# EAGLE design quahog_0.1.0 (EAGLE 7.6.0)
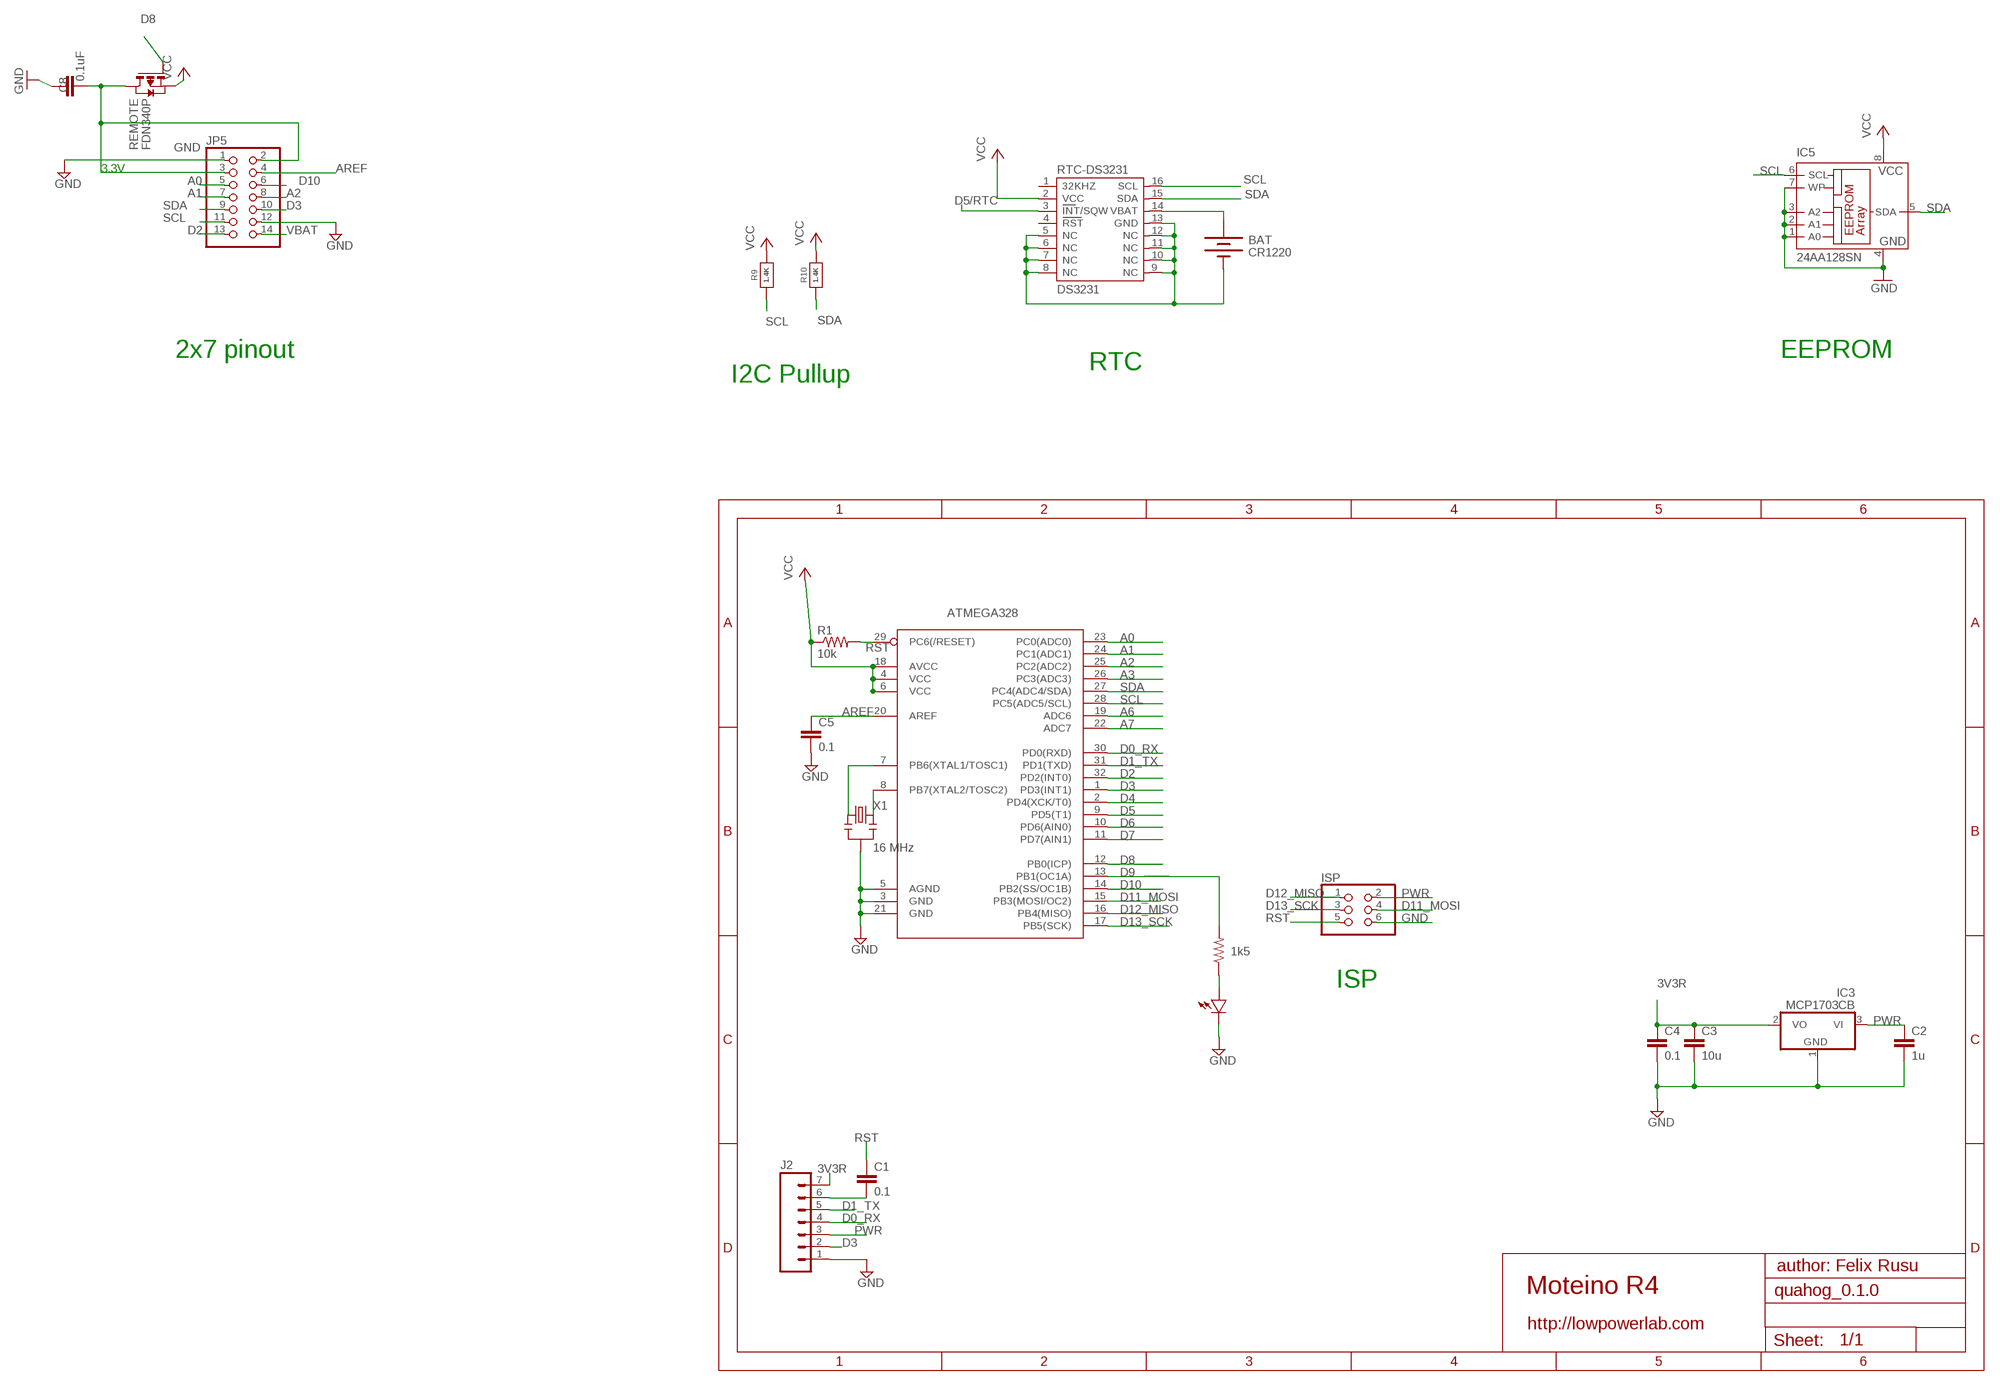
[diagram p0: schematic, sheet 1, part 1 of 2]
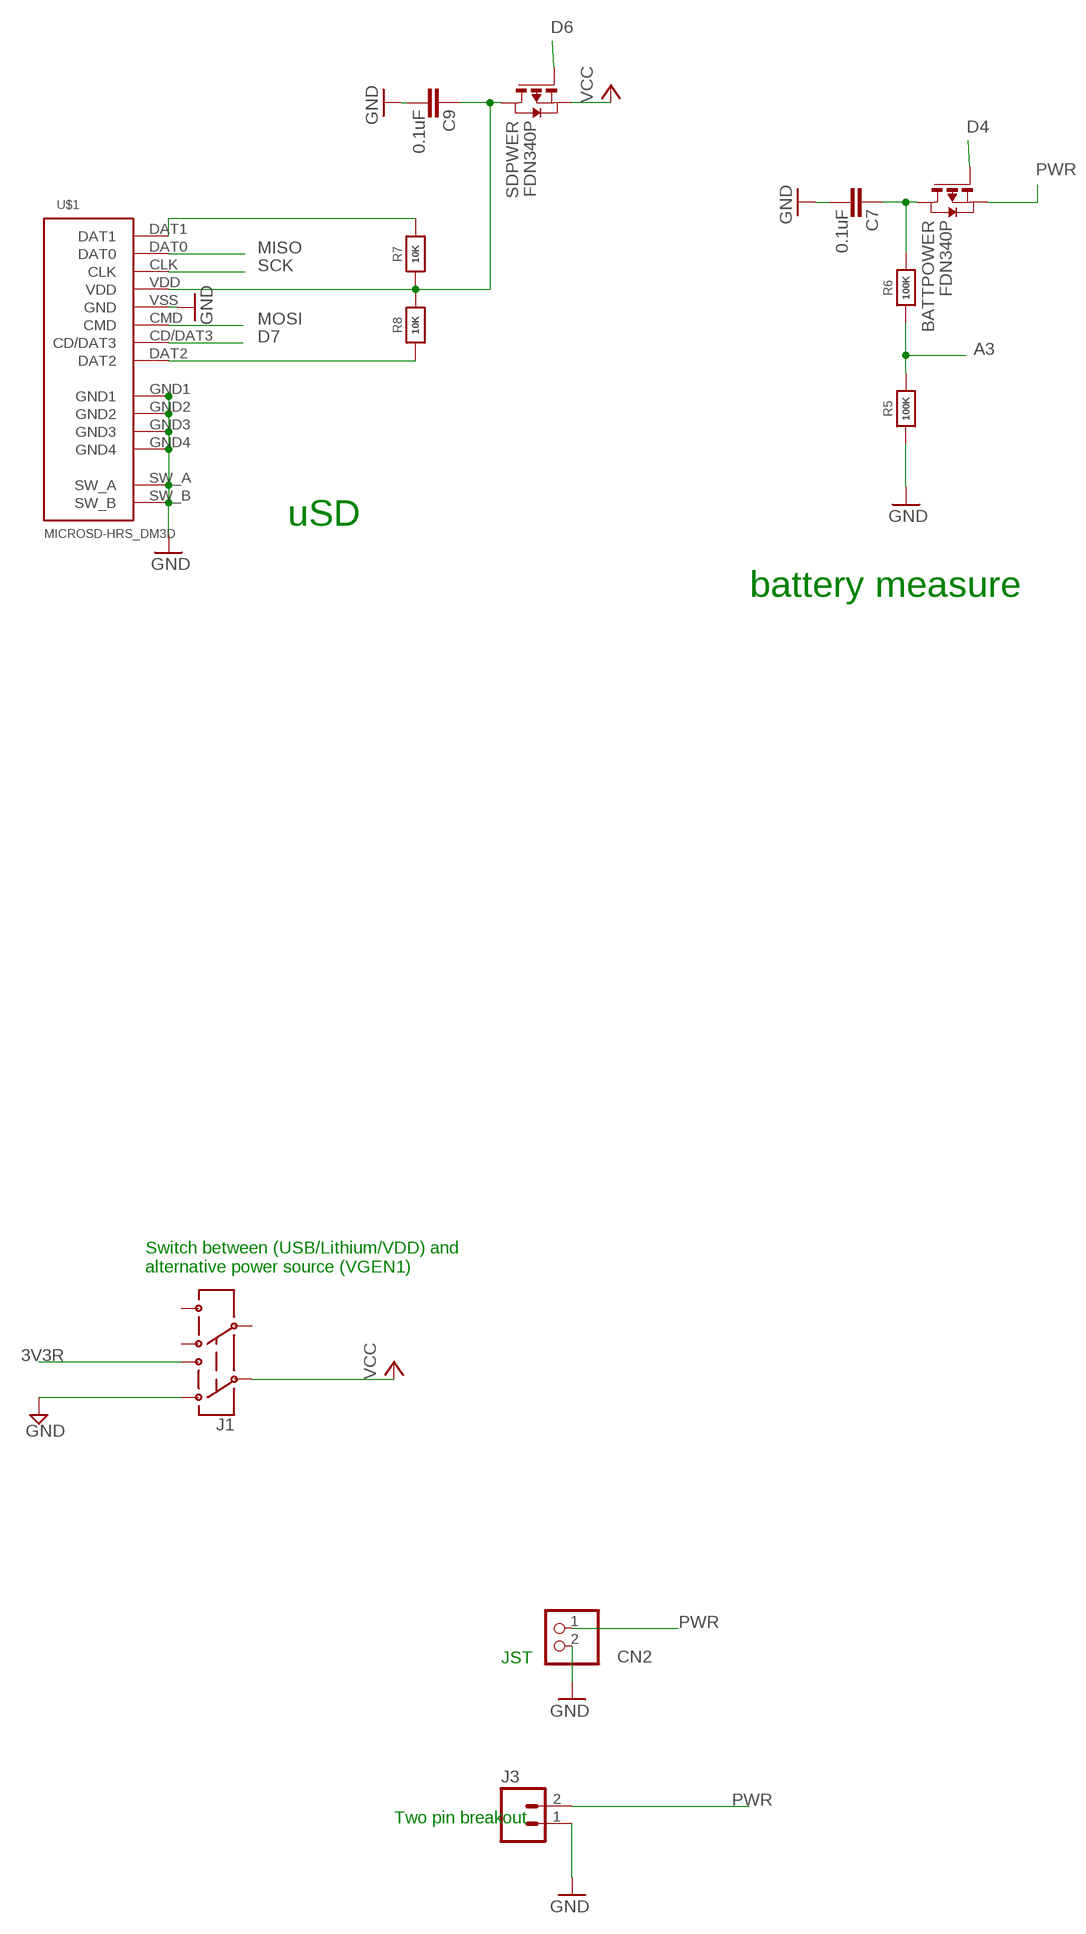
[diagram p1: schematic, sheet 1, part 2 of 2]

## Parts
ATMEGA328  ATMega-328  ATMEGA168/328TQFP32  [TQFP32-08]
BAT  CR1220  BATTERYBATTERY_12MM_SMT  [BATTCON_12MM_SMT]
BATTPOWER  FDN340P  PMOSSOT23  [SOT-23]
C1  0.1  CAP0603-CAP  [0603-CAP]
C2  1u  CAP0603-CAP  [0603-CAP]
C3  10u  CAP0805-CAP  [0805-CAP]
C4  0.1  CAP0603-CAP  [0603-CAP]
C5  0.1  CAP0603-CAP  [0603-CAP]
C7  0.1uF  CAP0603-CAP  [0603-CAP]
C8  0.1uF  CAP0603-CAP  [0603-CAP]
C9  0.1uF  CAP0603-CAP  [0603-CAP]
CN2  JST_2PIN-SMT-RA  [JST-PH-2-SMT-RA]
IC3  MCP1703CB  [SOT23]
IC5  24AA128SN  [SO-08]
ISP  PINHD-2X3  [2X03]
J1  AYZ0202  [AYZ0202]
J2  M07  [1X07]
J3  M02PTH  [1X02]
JP5  PINHD-2X7  [2X07]
R1  10k  RESISTOR0603-RES  [0603-RES]
R2  1k5  RESISTOR0603-RES  [0603-RES]
R5  100K  RESISTOR_0603_NOOUT  [0603-NO]
R6  100K  RESISTOR_0603_NOOUT  [0603-NO]
R7  10K  RESISTOR_0603_NOOUT  [0603-NO]
R8  10K  RESISTOR_0603_NOOUT  [0603-NO]
R9  1.4K  RESISTOR_0603_NOOUT  [0603-NO]
R10  1.4K  RESISTOR_0603_NOOUT  [0603-NO]
REMOTE  FDN340P  PMOSSOT23  [SOT-23]
RTC-DS3231  DS3231  [DS3231]
SDPWER  FDN340P  PMOSSOT23  [SOT-23]
U$1  MICROSD-HRS_DM3D  [DM3D]
U$2  LED0603  [0603-LED]
X1  16 MHz  RESONATORSMD  [RESONATOR-SMD]

## Nets
3V3R: C3.1 C4.1 IC3.2(VO) J1.1 J2.7
A0: ATMEGA328.23(PC0(ADC0)) JP5.5
A1: ATMEGA328.24(PC1(ADC1)) JP5.7
A2: ATMEGA328.25(PC2(ADC2)) JP5.8
A3: ATMEGA328.26(PC3(ADC3)) R5.2 R6.1
A6: ATMEGA328.19(ADC6)
A7: ATMEGA328.22(ADC7)
AREF: ATMEGA328.20(AREF) C5.1 JP5.4
D0_RX: ATMEGA328.30(PD0(RXD)) J2.4
D1_TX: ATMEGA328.31(PD1(TXD)) J2.5
D2: ATMEGA328.32(PD2(INT0)) JP5.13
D3: ATMEGA328.1(PD3(INT1)) J2.2 JP5.10
D4: ATMEGA328.2(PD4(XCK/T0)) BATTPOWER.3(G)
D5: ATMEGA328.9(PD5(T1))
D5/RTC: RTC-DS3231.3(INT/SQW)
D6: ATMEGA328.10(PD6(AIN0)) SDPWER.3(G)
D7: ATMEGA328.11(PD7(AIN1)) U$1.CD/DAT3
D8: ATMEGA328.12(PB0(ICP)) REMOTE.3(G)
D9: ATMEGA328.13(PB1(OC1A)) R2.2
D10: ATMEGA328.14(PB2(SS/OC1B)) JP5.6
D11_MOSI: ATMEGA328.15(PB3(MOSI/OC2)) ISP.4
D12_MISO: ATMEGA328.16(PB4(MISO)) ISP.1
D13_SCK: ATMEGA328.17(PB5(SCK)) ISP.3
GND [power]: ATMEGA328.3(GND) ATMEGA328.5(AGND) ATMEGA328.21(GND) BAT.P$1(-) C2.2 C3.2 C4.2 C5.2 C7.1 C8.2 C9.1 CN2.2 IC3.1(GND) IC5.1(A0) IC5.2(A1) IC5.3(A2) IC5.4(GND) IC5.7(WP) ISP.6 J1.3 J2.1 J3.1 JP5.1 JP5.12 R5.1 RTC-DS3231.5(NC) RTC-DS3231.6(NC) RTC-DS3231.7(NC) RTC-DS3231.8(NC) RTC-DS3231.9(NC) RTC-DS3231.10(NC) RTC-DS3231.11(NC) RTC-DS3231.12(NC) RTC-DS3231.13(GND) U$1.GND1 U$1.GND2 U$1.GND3 U$1.GND4 U$1.SW_A U$1.SW_B U$1.VSS(GND) U$2.MINUS X1.2
MISO: U$1.DAT0
MOSI: U$1.CMD
N$1: ATMEGA328.7(PB6(XTAL1/TOSC1)) X1.1
N$2: R2.1 U$2.PLUS
N$4: C9.2 R7.1 R8.2 SDPWER.1(D) U$1.VDD
N$7: C8.1 JP5.2 JP5.3 REMOTE.1(D)
N$15: BATTPOWER.1(D) C7.2 R6.2
N$16: R7.2 U$1.DAT1
N$18: R8.1 U$1.DAT2
N$20: C1.2 J2.6
N$21: ATMEGA328.8(PB7(XTAL2/TOSC2)) X1.3
PWR [power]: BATTPOWER.2(S) C2.1 CN2.1 IC3.3(VI) ISP.2 J2.3 J3.2
RST: ATMEGA328.29(PC6(/RESET)) C1.1 ISP.5 R1.2
RTC_BATT: BAT.P$2(+) RTC-DS3231.14(VBAT)
SCK: U$1.CLK
SCL: ATMEGA328.28(PC5(ADC5/SCL)) IC5.6(SCL) JP5.11 R9.1 RTC-DS3231.16(SCL)
SDA: ATMEGA328.27(PC4(ADC4/SDA)) IC5.5(SDA) JP5.9 R10.1 RTC-DS3231.15(SDA)
VBAT [power]: JP5.14
VCC: ATMEGA328.4(VCC) ATMEGA328.6(VCC) ATMEGA328.18(AVCC) IC5.8(VCC) J1.2 R1.1 R9.2 R10.2 REMOTE.2(S) RTC-DS3231.2(VCC) SDPWER.2(S)
Unconnected: J1.4 J1.5 J1.6 RTC-DS3231.1(32KHZ) RTC-DS3231.4(RST)

## Notes on the sheet
- 3.3V
- uSD
- 2x7 pinout | EEPROM
- RTC
- I2C Pullup
- battery measure
- Switch between (USB/Lithium/VDD) and 
  alternative power source (VGEN1)
- ISP
- JST
- Two pin breakout
- author: Felix Rusu
- Moteino R4
- http://lowpowerlab.com

## Library data of the parts
ATMEGA328 = LowPowerLab:ATMEGA168/328: Atmel 32-pin 8-bit micro, 16k flash.
BAT = SparkFunNew:BATTERY: Battery Holders Various common sizes : AA, AAA, 20mm coin cell and 12mm coin cell.
BATTPOWER REMOTE SDPWER = zetex:PMOSSOT23: MOS FET; OC_FARNELL: unknown; OC_NEWARK: unknown
C1-C5 = LowPowerLab:CAP: Capacitor Standard 0603 ceramic capacitor, and 0.1" leaded capacitor.
C7-C9 = SparkFun:CAP: Capacitor Standard 0603 ceramic capacitor, and 0.1" leaded capacitor.
CN2 = adafruit:JST_2PIN: JST 2-Pin Connectors of various flavors SMT-RA (S2B-PH-SM4) 4UConnector #17311 SMT (B2B-PH-SM4) THM-RA (S2B-PH) THM (B2B-PH)
IC3 = linear:MCP1703: 250 mA, 16V, Low Quiescent Current LDO Regulator Source: http://ww1.microchip.com/downloads/en/DeviceDoc/22049b.pdf
IC5 = microchip:24*: Serial EEPROM I2C; MF: MICROCHIP; MPN: 24AA128-I/SN; OC_FARNELL: unknown; OC_NEWARK: 92C6842
ISP = pinhead:PINHD-2X3: PIN HEADER
J1 = SparkFunNew:AYZ0202: SPDT Slide Switch Simple SMD single-pull double-throw slide switch. Good for less than 350mA power switch, switching UARTs between devices, etc. Spark Fun Electronics SKU : COM-00597
J2 = SparkFun-Connectors:M07: Header 7 Standard 7-pin 0.1" header. Use with straight break away headers (SKU : PRT-00116), right angle break away headers (PRT-00553), swiss pins (PRT-00743), machine pins (PRT-00117), and female headers (PRT-00115). NOTES ON THE VARIANTS LOCK and LOCK_LONGPADS... This footprint was designed to help hold the alignment of a through-hole component (i.e. 7-pin header) while soldering it into place. You may notice that each hole has been shifted either up or down by 0.005 of an inch from it's more standard position (which is usually a perfectly straight line). This slight alteration caused the pins (the squares in the middle) to touch the edges of the holes. Because they are alternating, it causes a "brace" to hold the header in place. 0.005 has proven to be the perfect amount of "off-center" position when using our standard breakaway headers. Although looks a little odd when you look at the bare footprint, once you have a header in there, the alteration is very hard to notice. Also, if you push a header all the way into place, it is covered up entirely on the bottom side. This idea of altering the position of holes to aid alignment will be further integrated into the Sparkfun Library for other footprints. It can help hold any component with 3 or more connection pins.
J3 = SparkFun-Connectors:M02: Standard 2-pin 0.1" header. Use with - straight break away headers ( PRT-00116) - right angle break away headers (PRT-00553) - swiss pins (PRT-00743) - machine pins (PRT-00117) - female headers (PRT-00115) Molex polarized connector foot print use with: PRT-08233 with associated crimp pins and housings. 2.54_SCREWTERM for use with PRT-10571. 3.5mm Screw Terminal footprints for PRT-08084 5mm Screw Terminal footprints for use with PRT-08432
JP5 = pinhead:PINHD-2X7: PIN HEADER
R1 R2 = LowPowerLab:RESISTOR: Resistor Basic schematic elements and footprints for 0603, 1206, and PTH resistors.
R5-R10 = microbuilder:RESISTOR: Resistors For new designs, use the packages preceded by an '_' character since they are more reliable: The following footprints should be used on most boards: _0402 - Standard footprint for regular board layouts _0603 - Standard footprint for regular board layouts _0805 - Standard footprint for regular board layouts _1206 - Standard footprint for regular board layouts For extremely tight-pitch boards where space is at a premium, the following 'micro-pitch' footprints can be used (smaller pads, no silkscreen outline, etc.): _0402MP - Micro-pitch footprint for very dense/compact boards _0603MP - Micro-pitch footprint for very dense/compact boards _0805MP - Micro-pitch footprint for very dense/compact boards _1206MP - Micro-pitch footprint for very dense/compact boards
RTC-DS3231 = _lh-library:DS3231
U$1 = hrs_DM3D-SF:MICROSD-HRS_DM3D
U$2 = LowPowerLab:LED
X1 = SparkFun:RESONATOR: Resonator Small SMD resonator. This is the itty bitty 10/20MHz resonators with built in caps. CSTCE10M0G55 and CSTCE20M0V53. Footprint has been reviewed closely but hasn't been tested yet.

## Net classes
1 power: width 0.305 mm

## Board
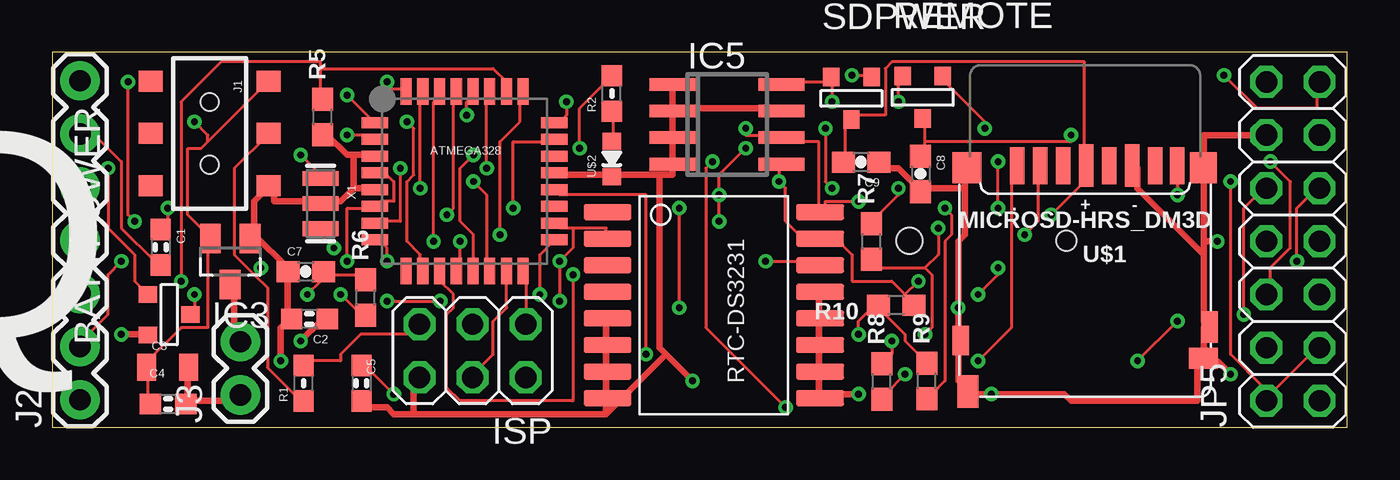
[diagram p2: board, top side]
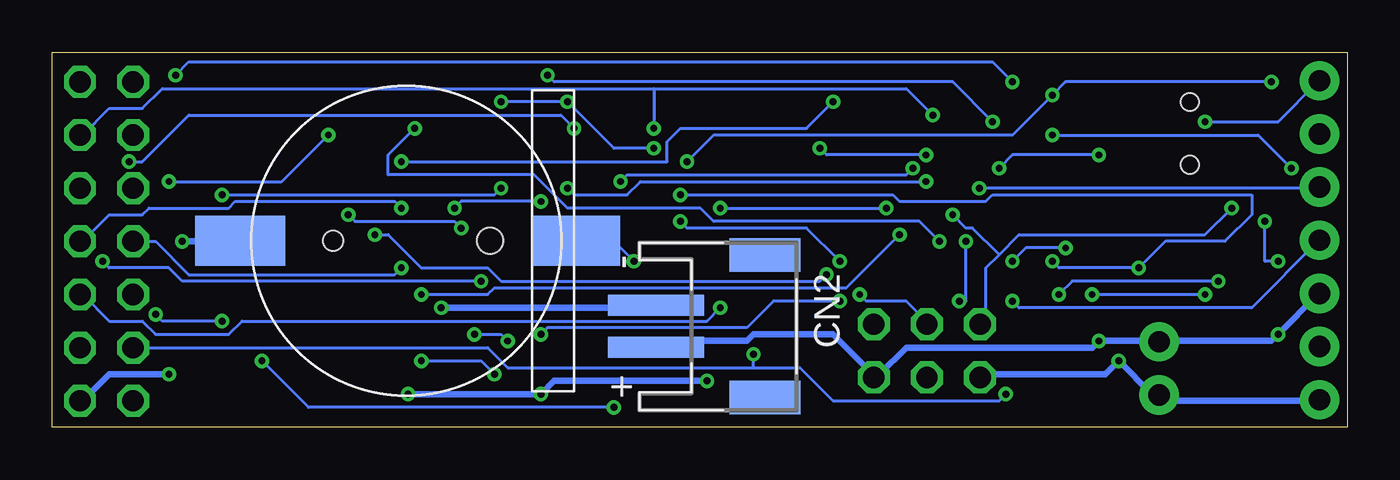
[diagram p3: board, bottom side, seen from below]

Size 61.9 x 17.92 mm. Coordinates in mm from the lower left corner, seen from the top.
Outline: 0,0 61.9,0 61.9,17.92 0,17.92 0,0
Copper layers (1*16): Top 0.0356mm / dielectric 1.5011mm / Bottom 0.0356mm
Design rules "oshpark-2layer": minimum track width 6mil, minimum drill 13mil, track to track 6mil, track to pad 6mil, pad to pad 6mil, via to via 6mil, smd to smd 6mil, copper to edge 15mil, drill to drill 6mil, minimum pad ring 7mil, minimum via ring 7mil, stop-mask expansion 2.5mil, vias tented up to drill 0mil, thermal gap 10mil

### Footprints (pad centres in the part's own frame; a part is rotated, then mirrored left to right if it is on the bottom)
TQFP32-08 = smd 1.27 x 0.533: 1 -4.293,2.8; 2 -4.293,2; 3 -4.293,1.2; 4 -4.293,0.4; 5 -4.293,-0.4; 6 -4.293,-1.2; 7 -4.293,-2; 8 -4.293,-2.8; 17 4.293,-2.8; 18 4.293,-2; 19 4.293,-1.2; 20 4.293,-0.4; 21 4.293,0.4; 22 4.293,1.2; 23 4.293,2; 24 4.293,2.8 | smd 0.533 x 1.27: 9 -2.8,-4.293; 10 -2,-4.293; 11 -1.2,-4.293; 12 -0.4,-4.293; 13 0.4,-4.293; 14 1.2,-4.293; 15 2,-4.293; 16 2.8,-4.293; 25 2.8,4.293; 26 2,4.293; 27 1.2,4.293; 28 0.4,4.293; 29 -0.4,4.293; 30 -1.2,4.293; 31 -2,4.293; 32 -2.8,4.293
BATTCON_12MM_SMT = smd 2.4 x 4.3: P$1 0,11.96 | smd 2.4 x 4.2: P$2 0,-4.1 | hole 0.95: 0,7.5 | hole 1.25: 0,0
SOT-23 = smd 0.787 x 0.889: 1 0.025,-1.016; 2 -0.94,1.016; 3 0.991,1.016
0603-CAP = smd 1.016 x 0.965: 1 -0.85,0; 2 0.85,0
0805-CAP = smd 0.902 x 1.3: 1 -1,0; 2 1,0
0603-CAP' = smd 1.1 x 1: 1 -0.85,0; 2 0.85,0
JST-PH-2-SMT-RA = smd 1 x 4.6: 1 1,-3.7; 2 -1,-3.7 | smd 1.6 x 3.4: NC1 -3.4,1.5; NC2 3.4,1.5
SOT23 = smd 1 x 1.4: 1 -0.95,-1.1; 2 0.95,-1.1; 3 0,1.1
SO-08 = smd 0.6 x 2.2: 1 -1.905,-2.6; 2 -0.635,-2.6; 3 0.635,-2.6; 4 1.905,-2.6; 5 1.905,2.6; 6 0.635,2.6; 7 -0.635,2.6; 8 -1.905,2.6
2X03 = drill 1.016 octagon: 1 -2.54,-1.27; 2 -2.54,1.27; 3 0,-1.27; 4 0,1.27; 5 2.54,-1.27; 6 2.54,1.27
AYZ0202 = smd 1 x 1.15: 1 -2.5,2.825; 2 0,2.825; 3 2.5,2.825; 4 -2.5,-2.825; 5 0,-2.825; 6 2.5,-2.825 | hole 0.85: 1.5,0; -1.5,0
1X07 = drill 1.016 pad 1.88: 1 0,0; 2 2.54,0; 3 5.08,0; 4 7.62,0; 5 10.16,0; 6 12.7,0; 7 15.24,0
1X02 = drill 1.016 pad 1.88: 1 0,0; 2 2.54,0
2X07 = drill 1.016 octagon: 1 -7.62,-1.27; 2 -7.62,1.27; 3 -5.08,-1.27; 4 -5.08,1.27; 5 -2.54,-1.27; 6 -2.54,1.27; 7 0,-1.27; 8 0,1.27; 9 2.54,-1.27; 10 2.54,1.27; 11 5.08,-1.27; 12 5.08,1.27; 13 7.62,-1.27; 14 7.62,1.27
0603-RES = smd 1.016 x 0.965: 1 -0.85,0; 2 0.85,0
0603-NO = smd 1.1 x 1: 1 -0.85,0; 2 0.85,0
DS3231 = smd 0.762 x 2.286: 1 -4.445,-5.08; 2 -3.175,-5.08; 3 -1.905,-5.08; 4 -0.635,-5.08; 5 0.635,-5.08; 6 1.905,-5.08; 7 3.175,-5.08; 8 4.445,-5.08; 9 4.445,5.08; 10 3.175,5.08; 11 1.905,5.08; 12 0.635,5.08; 13 -0.635,5.08; 14 -1.905,5.08; 15 -3.175,5.08; 16 -4.445,5.08
DM3D = smd 0.7 x 1.75: CD/DAT3 8.15,0.45; CLK 4.85,0.45; CMD 7.05,0.45; DAT0 2.65,0.45; DAT1 1.6,0.45; DAT2 9.25,0.45 | smd 0.8 x 1.5: GND1 0.05,8.15 | smd 0.8 x 1.4: GND2 11.95,8.8 | smd 1.4 x 1.5: GND3 11.65,0.55 | smd 1.3 x 1.5: GND4 0.35,0.55 | smd 1 x 1.55: SW_A 11.6,11.25 | smd 1.4 x 1: SW_B 0.35,9.65 | smd 0.7 x 2.032: VDD 5.95,0.45; VSS 3.75,0.45
0603-LED = smd 0.8 x 0.9: MINUS -0.85,0; PLUS 0.85,0
RESONATOR-SMD = smd 0.7 x 1.7: 1 -1.2,0; 2 0,0; 3 1.2,0

### Placement (x,y rotation side)
ATMEGA328  19.71,11.76 0 top
BAT  40.97,8.92 90 bottom
BATTPOWER  5.59,5.36 90 top
C1  5.18,8.61 270 top
C2  12.29,5.18 180 top
C3  5.51,2.87 0 top
C4  5.54,1.12 0 top
C5  14.78,2.11 270 top
C7  0.1uF  [0603-CAP']  12.12,7.44 0 top
C8  0.1uF  [0603-CAP']  41.5,12.12 270 top
C9  0.1uF  [0603-CAP']  38.66,12.67 180 top
CN2  29.34,4.83 270 bottom
IC3  8.51,7.92 180 top
IC5  32.26,14.48 270 top
ISP  20.09,3.66 180 top
J1  7.52,14.05 270 top
J2  1.32,1.32 90 top
J3  8.99,1.55 90 top
JP5  59.31,8.89 90 top
R1  12.01,2.11 90 top
R2  26.75,15.95 90 top
R5  12.93,14.83 90 top
R6  14.99,6.2 90 top
R7  39.17,8.89 90 top
R8  39.65,2.18 90 top
R9  41.81,2.21 90 top
R10  40.34,5.84 180 top
REMOTE  41.58,15.77 0 top
RTC-DS3231  31.62,5.84 270 top
SDPWER  38.18,15.72 0 top
U$1  55.37,12.95 180 top
U$2  26.75,12.83 90 top
X1  12.83,10.69 270 top

### Tracks (layer width: path | path; a pad name or v marks a point on that pad's centre or on a via)
3V3R  (via drill 0.33)
  Top 0.152: C4.1 4.57,1.27 4.57,2.86 C3.1 4.57,3.17 6.16,4.76 7.43,4.76 7.43,8.89 IC3.2 7.43,9.21 6.48,10.16 6.48,13.34 7.11,13.34 7.43,13.65 | 7.43,13.65 10.29,16.51 J1.1 | v6.79,14.61 7.43,13.97 7.43,13.65
  Bottom 0.152: v6.79,14.61 3.3,14.61 1.4,16.51 J2.7
A0  (via drill 0.33)
  Top 0.152: v22.04,10.48 22.04,13.65 23.94,13.65 ATMEGA328.23 | v29.97,5.71 v29.97,10.48
  Bottom 0.152: v29.97,10.48 v22.04,10.48 | v29.97,5.71 30.61,5.08 52.83,5.08 53.47,4.45 56.96,4.45 57.59,5.08 59.18,5.08 60.45,6.35 JP5.5
A1  (via drill 0.33)
  Top 0.152: v24.57,15.56 24.57,14.92 24.26,14.61 ATMEGA328.24 | v45.21,10.48 v45.21,12.7
  Bottom 0.152: v24.57,15.56 25.84,14.29 31.88,14.29 32.51,13.65 32.51,12.7 v45.21,12.7 | v45.21,10.48 45.53,10.79 53.15,10.79 53.47,10.48 57.28,10.48 57.59,10.16 59.18,10.16 60.45,8.89 JP5.7
A2  (via drill 0.33)
  Top 0.152: v21.4,9.21 21.4,13.65 22.35,14.61 22.35,15.88 ATMEGA328.25 | v44.26,6.35 45.21,7.3 v45.21,7.62
  Bottom 0.152: v21.4,9.21 23.94,6.67 40.77,6.67 41.08,6.35 v44.26,6.35 | v45.21,7.62 45.53,7.3 55.37,7.3 56.96,8.89 JP5.8
A3  (via drill 0.33)
  Top 0.152: v13.78,6.35 14.73,5.4 R6.1 | v6.16,6.99 6.16,15.56 8.06,17.46 12.83,17.46 12.83,17.14 | 12.83,17.14 12.83,15.88 R5.2 | 12.83,17.14 21.08,17.14 21.72,16.51 21.72,16.19 ATMEGA328.26
  Bottom 0.152: v13.78,6.35 13.14,6.99 v6.16,6.99
AREF  (via drill 0.33)
  Top 0.152: v16.32,1.59 15.05,2.86 C5.1 | v28.38,3.49 28.38,11.11 24.26,11.11 ATMEGA328.20
  Bottom 0.152: v16.32,1.59 16.64,1.27 24.57,1.27 26.16,2.86 28.38,2.86 | 28.38,2.86 40.13,2.86 41.08,3.81 JP5.4 | 28.38,2.86 v28.38,3.49
D0_RX  (via drill 0.33)
  Top 0.152: v18.22,8.89 18.22,15.56 18.54,15.88 ATMEGA328.30 | v16,6.03 v18.54,6.03
  Bottom 0.152: v18.22,8.89 18.22,6.03 v18.54,6.03 | v16,6.03 15.68,5.71 4.57,5.71 1.4,8.89 J2.4
D1_TX  (via drill 0.33)
  Top 0.152: v17.59,11.43 17.59,15.88 ATMEGA328.31
  Bottom 0.152: v17.59,11.43 1.4,11.43 J2.5
D2  (via drill 0.33)
  Top 0.152: v16,16.51 16,16.19 16.95,16.19 ATMEGA328.32 | v56.01,16.83 57.59,15.24 60.45,15.24 60.45,16.51 JP5.13
  Bottom 0.152: v16,16.51 16.95,17.46 55.37,17.46 v56.01,16.83
D3  (via drill 0.33)
  Top 0.152: v14.1,15.88 15.37,14.61 ATMEGA328.1 | v3.62,16.51 3.62,10.16 v3.94,9.84 | v3.3,7.94 2.67,7.3 2.67,5.4 1.4,4.13 J2.2 | v56.96,5.4 56.96,10.48 57.91,11.43 JP5.10 | v51.88,3.17 v53.78,5.08 | v35.05,0.95 31.24,4.76 31.24,12.38 v31.56,12.7
  Bottom 0.152: v3.62,16.51 13.46,16.51 v14.1,15.88 16,13.97 30.29,13.97 v31.56,12.7 | v3.94,9.84 3.94,7.94 v3.3,7.94 | v56.96,5.4 56.64,5.08 v53.78,5.08 | v51.88,3.17 49.66,0.95 v35.05,0.95
D4  (via drill 0.33)
  Top 0.152: BATTPOWER.3 3.94,6.99 3.94,8.26 2.67,9.53 v2.67,12.38 | v14.1,13.97 15.37,13.97 ATMEGA328.2
  Bottom 0.152: v2.67,12.38 4.25,13.97 v14.1,13.97
D6  (via drill 0.33)
  Top 0.152: v38.23,16.83 38.86,16.83 SDPWER.3 | v16.95,14.61 17.27,14.29 17.27,12.06 16.95,11.75 16.95,8.89 17.59,8.26 17.59,7.62 ATMEGA328.10
  Bottom 0.152: v38.23,16.83 37.91,16.51 18.86,16.51 v16.95,14.61
D7  (via drill 0.33)
  Top 0.152: v24.89,7.3 24.89,1.27 19.49,1.27 18.86,1.91 18.86,5.4 19.18,5.71 19.18,6.35 18.54,6.99 18.54,7.3 ATMEGA328.11 | v46.48,9.21 47.12,9.84 47.12,12.38 U$1.CD/DAT3
  Bottom 0.152: v24.89,7.3 25.21,6.99 40.45,6.99 41.08,7.62 44.26,7.62 45.85,9.21 v46.48,9.21
D8  (via drill 0.33)
  Top 0.152: v44.58,14.29 44.58,14.61 42.67,16.51 REMOTE.3 | v19.49,8.89 19.49,7.62 ATMEGA328.12
  Bottom 0.152: v44.58,14.29 45.85,13.02 45.85,12.06 38.86,12.06 37.27,10.48 30.92,10.48 30.29,9.84 20.45,9.84 v19.49,8.89
D9  (via drill 0.33)
  Top 0.152: v25.21,13.34 25.21,15.24 26.48,16.51 R2.2 | v20.13,13.02 19.49,12.38 19.49,9.84 20.13,9.21 20.13,7.62 ATMEGA328.13
  Bottom 0.152: v25.21,13.34 24.89,13.02 v20.13,13.02
D10  (via drill 0.33)
  Top 0.152: v20.13,11.75 20.77,11.11 20.77,7.62 ATMEGA328.14 | v37.27,11.43 36.96,11.75 v36.96,14.29 | v58.23,12.7 59.18,11.75 59.18,8.57 58.23,7.62 58.23,6.35 JP5.6
  Bottom 0.152: v20.13,11.75 33.78,11.75 34.42,11.11 36.96,11.11 v37.27,11.43 | v36.96,14.29 37.59,14.92 55.37,14.92 57.59,12.7 v58.23,12.7
D11_MOSI
  Top 0.152: ATMEGA328.15 21.72,7.3 21.72,5.71 21.08,5.08 21.08,3.49 20.13,2.54 ISP.4
D12_MISO
  Top 0.152: ATMEGA328.16 22.67,7.3 22.67,5.08 ISP.1
D13_SCK  (via drill 0.33)
  Top 0.152: v23.31,6.35 23.31,8.26 23.94,8.89 ATMEGA328.17
  Bottom 0.152: v23.31,6.35 22.99,6.03 21.08,6.03 20.13,5.08 ISP.3
GND  (via drill 0.33)
  Top 0.305: RTC-DS3231.13 36.64,6.35 36.64,5.4 RTC-DS3231.12 36.64,5.08 36.64,4.13 RTC-DS3231.11 36.64,3.81 36.64,2.86 RTC-DS3231.10 36.64,2.54 36.64,1.59 RTC-DS3231.9 36.96,1.59 v38.55,1.59 | 43.62,11.43 41.72,11.43 C8.2 41.4,11.43 40.45,12.38 39.81,12.38 C9.1 | 43.62,11.43 43.62,12.38 U$1.GND3 | 43.62,11.43 43.62,9.21 43.31,8.89 v43.31,5.71 43.31,4.45 U$1.GND2 43.31,4.13 43.31,2.22 43.62,1.91 U$1.SW_A 43.94,1.59 v44.89,1.59 48.39,1.59 48.7,1.27 54.74,1.27 54.74,3.17 U$1.SW_B 55.06,3.49 55.06,3.81 | 55.06,3.81 55.06,4.76 U$1.GND1 55.06,5.08 55.06,8.26 | 55.06,8.26 55.06,8.89 | 55.06,8.89 55.06,12.38 U$1.GND4 55.06,12.7 55.06,13.97 JP5.12 | 55.06,8.26 51.88,11.43 51.88,12.38 U$1.VSS | 55.06,3.81 v56.32,2.54 | 55.06,8.89 v55.69,8.89 | 14.41,13.02 15.37,13.02 ATMEGA328.3 | 14.41,13.02 14.1,13.02 13.14,13.97 R5.1 | 14.41,11.43 15.37,11.43 ATMEGA328.5 | 14.41,13.02 14.41,11.43 | 9.65,9.21 9.65,10.79 10.29,11.43 J1.3 10.61,11.43 10.61,10.79 12.83,10.79 | 9.65,9.21 11.24,7.62 C7.1 11.24,7.3 11.24,5.4 C2.2 11.24,5.08 10.92,4.76 v10.92,3.17 | 9.65,9.21 IC3.1 | 14.41,11.43 13.78,10.79 12.83,10.79 | 12.83,10.79 X1.2 | 6.48,1.27 6.48,2.86 C3.2 | 6.48,1.27 8.7,1.27 J3.1 | 6.48,1.27 C4.2 | ATMEGA328.21 24.26,12.06 26.48,12.06 U$2.MINUS 26.8,12.06 29.02,12.06 | 29.02,12.06 29.65,12.06 29.65,12.38 IC5.4 29.65,12.7 29.65,13.65 IC5.3 29.65,13.97 29.65,14.92 IC5.2 | IC5.1 29.65,16.19 29.65,15.24 IC5.2 | IC5.7 34.73,15.24 29.97,15.24 IC5.2 | 17.27,0.64 16.32,0.64 16,0.95 15.05,0.95 C5.2 | 17.27,0.64 17.27,2.22 ISP.6 | RTC-DS3231.5 26.48,5.08 26.48,4.13 RTC-DS3231.6 26.48,3.81 26.48,2.86 RTC-DS3231.7 26.48,2.54 26.48,1.59 RTC-DS3231.8 26.48,1.27 26.48,0.64
  Top 0.305: 26.48,0.64 17.27,0.64 | 29.02,12.06 29.02,3.81 29.34,3.49 | 26.48,0.64 29.34,3.49 | 29.34,3.49 v30.61,2.22
  Bottom 0.305: v44.89,1.59 v38.55,1.59 37.91,2.22 v30.61,2.22 | v43.31,5.71 33.15,5.71 CN2.2 | v56.32,2.54 59.18,2.54 60.45,1.27 JP5.1 | v55.69,8.89 53.15,8.89 BAT.P$1 | J2.1 1.4,1.27 8.7,1.27 J3.1 9.02,1.59 9.34,1.59 v10.92,3.17 11.56,2.54 17.27,2.54 ISP.6
N$1  (via drill 0.33)
  Top 0.152: v16.64,12.38 16.64,9.84 15.68,9.84 ATMEGA328.7 | v11.88,13.02 12.83,12.06 X1.1
  Bottom 0.152: v16.64,12.38 16,13.02 v11.88,13.02
N$2
  Top 0.152: U$2.PLUS 26.8,13.97 26.8,14.92 R2.1
N$4  (via drill 0.33)
  Top 0.152: v40.13,4.13 40.13,3.49 39.81,3.17 R8.2 | v41.72,4.45 42.04,4.76 42.04,7.3 41.72,7.62 | 41.72,7.62 39.18,7.62 39.18,7.94 R7.1 | C9.2 37.91,12.7 37.91,14.61 SDPWER.1 38.23,14.92 39.81,14.92 39.81,17.14 40.13,17.46 49.34,17.46 49.34,12.7 U$1.VDD 49.34,12.38 49.34,11.75 v47.75,10.16 | 41.72,7.62 42.35,8.26 v42.35,9.53
  Bottom 0.152: v40.13,4.13 40.45,4.45 v41.72,4.45 | v42.35,9.53 42.67,9.84 47.44,9.84 v47.75,10.16
N$7  (via drill 0.33)
  Top 0.152: 41.72,13.65 41.72,13.02 C8.1 | 41.72,13.65 41.72,14.61 REMOTE.1 | 41.72,13.65 48.7,13.65 v48.7,13.97 | v56.32,11.75 56.32,3.49 57.91,1.91 57.91,1.27 JP5.2 58.23,1.27 58.23,1.59 60.45,3.81 JP5.3
  Bottom 0.152: v48.7,13.97 50.93,11.75 v56.32,11.75
N$15  (via drill 0.33)
  Top 0.152: v6.79,6.35 6.79,5.4 BATTPOWER.1 | v12.19,6.35 12.83,6.99 12.83,7.3 C7.2 13.14,7.3 14.73,7.3 R6.2
  Bottom 0.152: v12.19,6.35 v6.79,6.35
N$16  (via drill 0.33)
  Top 0.152: v40.45,11.43 40.45,11.11 39.18,9.84 R7.2 | v53.78,11.11 53.78,12.38 U$1.DAT1
  Bottom 0.152: v40.45,11.43 40.77,11.11 v53.78,11.11
N$18  (via drill 0.33)
  Top 0.152: v40.77,2.54 39.81,1.59 R8.1 | v44.26,3.17 45.85,4.76 45.85,12.38 U$1.DAT2
  Bottom 0.152: v40.77,2.54 41.4,3.17 v44.26,3.17
N$20
  Top 0.152: C1.2 4.89,7.94 3.3,9.53 3.3,12.7 2.03,13.97 1.4,13.97 J2.6
N$21  (via drill 0.33)
  Top 0.152: v16,7.94 16,8.57 15.68,8.89 ATMEGA328.8 | v13.46,8.57 12.83,9.21 X1.3
  Bottom 0.152: v16,7.94 15.37,8.57 v13.46,8.57
PWR  (via drill 0.33)
  Top 0.305: v3.3,4.45 4.57,4.45 BATTPOWER.2 | v11.88,4.13 12.83,5.08 C2.1 | IC3.3 8.7,6.67 8.7,4.13 J3.2
  Bottom 0.305: J2.3 1.4,6.35 v3.3,4.45 3.62,4.13 8.7,4.13 J3.2 9.02,4.13 v11.88,4.13 12.19,3.81 21.08,3.81 22.35,2.54 ISP.2 22.67,2.54 24.57,4.45 28.38,4.45 28.7,4.13 32.83,4.13 CN2.1
RST  (via drill 0.33)
  Top 0.152: v5.52,10.48 5.52,9.84 5.21,9.53 C1.1 | R1.2 12.19,3.17 13.78,3.17 13.78,3.49 14.73,4.45 17.27,4.45 17.27,4.76 ISP.5 | v18.86,10.16 19.18,10.48 19.18,15.88 ATMEGA328.29
  Bottom 0.152: v5.52,10.48 6.79,9.21 15.68,9.21 16.64,8.26 | 16.64,8.26 17.27,7.62 17.27,5.08 ISP.5 | v18.86,10.16 18.22,9.53 17.91,9.53 16.64,8.26
RTC_BATT  (via drill 0.33)
  Top 0.152: v34.1,7.94 36.64,7.94 RTC-DS3231.14
  Bottom 0.152: v34.1,7.94 35.05,8.89 36.64,8.89 BAT.P$2
SCL  (via drill 0.33)
  Top 0.152: v42.67,10.48 42.99,10.16 42.99,9.21 42.67,8.89 42.67,2.22 42.04,1.59 R9.1 | v38.55,10.79 36.96,10.79 36.96,10.48 RTC-DS3231.16 36.64,10.48 36.64,13.65 35.05,13.65 IC5.6 34.73,13.97 33.15,13.97 v33.15,14.29 | v19.81,14.92 19.81,15.56 20.13,15.88 ATMEGA328.28
  Bottom 0.152: v42.67,10.48 42.35,10.79 v38.55,10.79 | v19.81,14.92 21.08,16.19 33.15,16.19 | 33.15,16.19 56.64,16.19 57.59,15.24 59.18,15.24 60.45,13.97 JP5.11 | 33.15,16.19 v33.15,14.29
SDA  (via drill 0.33)
  Top 0.152: v20.77,12.38 20.77,15.88 ATMEGA328.27 | IC5.5 34.73,12.38 v34.73,11.75 35.05,11.43 35.05,9.84 35.69,9.21 36.64,9.21 RTC-DS3231.15 36.96,8.89 37.59,8.89 38.23,8.26 38.23,6.99 40.13,6.99 40.77,6.35 | 40.77,6.35 41.08,6.03 R10.1 | v59.5,7.94 59.5,10.48 60.45,11.43 JP5.9 | 40.77,6.35 v41.4,6.99
  Bottom 0.152: v20.77,12.38 21.08,12.06 34.42,12.06 v34.73,11.75 | v59.5,7.94 59.18,7.62 56.32,7.62 55.69,6.99 v41.4,6.99
VCC  (via drill 0.33)
  Top 0.152: ATMEGA328.4 15.68,12.38 16.32,11.75 16.32,10.79 15.68,10.79 ATMEGA328.6 15.37,10.48 14.1,10.48 v14.1,7.94 | 9.65,7.3 8.7,8.26 8.7,12.38 10.29,13.97 J1.2 | 9.65,7.3 10.29,6.67 10.29,2.86 11.88,1.27 R1.1 | 9.65,7.3 v9.97,7.62 | IC5.8 35.05,16.51 36.96,16.51 SDPWER.2 37.27,16.51 v37.27,15.56 | v40.45,15.56 40.45,16.51 REMOTE.2 | R9.2 41.72,3.17 40.77,4.13 40.77,4.45 39.5,5.71 R10.2 39.18,5.71 38.55,5.08 v38.55,4.45 | 24.89,9.53 26.48,9.53 26.48,9.21 RTC-DS3231.2 | 24.89,9.53 24.26,9.53 ATMEGA328.18 | v24.26,6.03 v24.26,7.94 24.89,8.57 24.89,9.53 | v33.15,13.34 31.88,12.06 v31.88,11.11 v31.88,9.84
  Bottom 0.152: v14.1,7.94 13.78,7.62 v9.97,7.62 8.7,8.89 5.84,8.89 4.57,10.16 4.57,11.11 16.95,11.11 17.27,10.79 21.4,10.79 21.72,11.11 v31.88,11.11 | v40.45,15.56 v37.27,15.56 35.05,13.34 v33.15,13.34 | v38.55,4.45 38.23,4.76 28.7,4.76 27.43,6.03 v24.26,6.03 | v31.88,9.84 31.56,9.53 25.84,9.53 v24.26,7.94

### Text on the board
tPlace: Q